# Altium project MP1484.PrjPcb
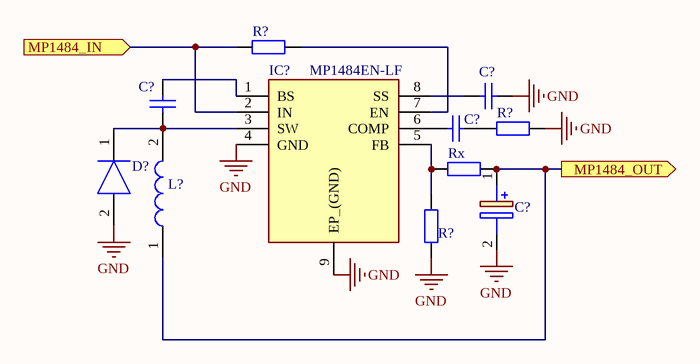
[diagram p0: Sheet1.SchDoc]
1 sheet, 11 parts. Net scope: flat (ports and power ports of the same name join across sheets).
Board file: PCB1.PcbDoc

## Sheet Sheet1.SchDoc
size A4

### Parts
(Parts that share a designator on the sheet are numbered #1, #2 ... from top to bottom, then left to right.)
C?#1  100nF (104) 10% 50V  [0603_C]  (value not drawn)
C?#2  6.8nF (682) 10% 50V  [0603_C]  (value not drawn)
C?#3  10nF (103) 10% 50V  [0603_C]  (value not drawn)
C?#4  10uF 4.5V tan  [CAPPM7343X310N]  (value not drawn)
D?  B130LAW-7-F  [SOD3716X145N]  (value not drawn)
IC?  MP1484EN-LF  [SOIC127P600X170-9N]
L?  1040 10UH 5A  [74404064470]  (value not drawn)
R?#1  100KΩ (1003) ±1%  [0603_R]  (value not drawn)
R?#2  6.8KΩ (6801) ±1%  [0603_R]  (value not drawn)
R?#3  10KΩ (1002) ±1%  [0603_R]  (value not drawn)
Rx  44.2K  [0603_R]  (value not drawn)

### Ports
MP1484_IN (in), MP1484_OUT (out)

### Nets
GND: C?#1.2 C?#4.2(-) D?.2(A) IC?.4(GND) IC?.9(EP_(GND)) R?#2.2 R?#3.1
NetC?#1_1: C?#1.1 IC?.8(SS)
NetC?#2_1: C?#2.1 IC?.6(COMP)
NetC?#2_2: C?#2.2 R?#2.1
NetC?#3_1: C?#3.1 D?.1(K) IC?.3(SW) L?.2
NetC?#3_2: C?#3.2 IC?.1(BS)
NetC?#4_1: C?#4.1(+) L?.1 Rx.2 ; port MP1484_OUT
NetIC?_2: IC?.2(IN) R?#1.1 ; port MP1484_IN
NetIC?_5: IC?.5(FB) R?#3.2 Rx.1
NetIC?_7: IC?.7(EN) R?#1.2

### Library data of the parts
C?#1 = 0603 100nF (104) 10% 50V: 贴片电容; ComponentLink1Description: 供应商链接; ComponentLink1URL: http://www.szlcsc.com/product/details_15331.html; Package: 0603; Supplier: LC; SuppliersPartNumber: C14663
C?#2 = 0603 6.8nF (682) 10% 50V: 贴片电容; ComponentLink1Description: 供应商链接; ComponentLink1URL: http://www.szlcsc.com/product/details_1983.html; Package: 0603; Supplier: LC; SuppliersPartNumber: C1631
C?#3 = 0603 10nF (103) 10% 50V: 贴片电容; ComponentLink1Description: 供应商链接; ComponentLink1URL: http://www.szlcsc.com/product/details_58143.html; Package: 0603; Supplier: LC; SuppliersPartNumber: C57112
C?#4 = T494D106K035AH: Manufacturer_Name: Kemet; Datasheet Link: http://www.mouser.com/ds/2/212/kemet_kem_t2008_t494-544880.pdf; Height: 3.1mm; Manufacturer_Part_Number: T494D106K035AH; Mouser Part Number: 80-T494D106K035AH; Mouser Price/Stock: https://www.mouser.com/Search/Refine.aspx?Keyword=80-T494D106K035AH
D? = B130LAW-7-F: Diode; Manufacturer_Name: Diodes Inc.; Allied_Number: 70437536; Datasheet Link: http://docs-emea.rs-online.com/webdocs/104e/0900766b8104e347.pdf; Height: 1.45mm; Manufacturer_Part_Number: B130LAW-7-F; Mouser Part Number: 621-B130LAW-F; Mouser Price/Stock: https://www.mouser.com/Search/Refine.aspx?Keyword=621-B130LAW-F; RS Part Number: 7513193P; RS Price/Stock: http://uk.rs-online.com/web/p/products/7513193P; Allied Price/Stock: http://www.alliedelec.com/diodes-inc-b130law-7-f/70437536/
IC? = MP1484EN-LF: Integrated Circuit; Manufacturer_Name: Monolithic Power Systems (MPS); Datasheet Link: http://www.mouser.com/datasheet/2/277/MP1484-1186021.pdf; Height: 1.7mm; Manufacturer_Part_Number: MP1484EN-LF; Mouser Part Number: 946-MP1484ENLF; Mouser Price/Stock: https://www.mouser.com/Search/Refine.aspx?Keyword=946-MP1484ENLF
L? = 74404064100: Inductor; Manufacturer_Name: Wurth Elektronik; Datasheet Link: https://katalog.we-online.com/pbs/datasheet/74404064100.pdf; Height: 4mm; Manufacturer_Part_Number: 74404064100; Mouser Part Number: 710-74404064100; Mouser Price/Stock: https://www.mouser.com/Search/Refine.aspx?Keyword=710-74404064100; RS Part Number: 8142663P; RS Price/Stock: http://uk.rs-online.com/web/p/products/8142663P
R?#1 = 0603 100KΩ (1003) 1%: 贴片电阻; ComponentLink1Description: 供应商链接; ComponentLink1URL: http://www.szlcsc.com/product/details_26546.html; Package: 0603; Supplier: LC; SuppliersPartNumber: C25803
R?#2 = 0603 6.8KΩ (6801) 1%: 贴片电阻; ComponentLink1Description: 供应商链接; ComponentLink1URL: http://www.szlcsc.com/product/details_23939.html; Package: 0603; Supplier: LC; SuppliersPartNumber: C23212
R?#3 = 0603 10KΩ (1002) 1%: 贴片电阻; ComponentLink1Description: 供应商链接; ComponentLink1URL: http://www.szlcsc.com/product/details_26547.html; Package: 0603; Supplier: LC; SuppliersPartNumber: C25804
Rx = 0603 1.5KΩ (1501) 1%: 贴片电阻; ComponentLink1Description: 供应商链接; ComponentLink1URL: http://www.szlcsc.com/product/details_23570.html; Package: 0603; Supplier: LC; SuppliersPartNumber: C22843